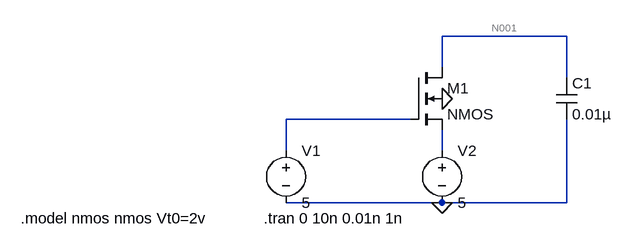
[diagram p0: schematic series_pass.asc]
series_pass.asc, the LTspice schematic file:
Version 4
SHEET 1 880 680
WIRE 448 32 256 32
WIRE 256 80 256 32
WIRE 448 96 448 32
WIRE 208 160 16 160
WIRE 16 208 16 160
WIRE 256 208 256 176
WIRE 256 288 16 288
WIRE 448 288 448 160
WIRE 448 288 256 288
FLAG 256 128 0
FLAG 256 288 0
SYMBOL voltage 16 192 R0
WINDOW 123 0 0 Left 2
WINDOW 39 0 0 Left 2
SYMATTR InstName V1
SYMATTR Value 5
SYMBOL voltage 256 192 R0
WINDOW 123 0 0 Left 2
WINDOW 39 0 0 Left 2
SYMATTR InstName V2
SYMATTR Value 5
SYMBOL nmos4 208 80 R0
SYMATTR InstName M1
SYMATTR Value2 l=5 w=10
SYMBOL cap 432 96 R0
SYMATTR InstName C1
SYMATTR Value 0.01µ
TEXT -18 312 Left 2 !.tran 0 10n 0.01n 1n
TEXT -392 312 Left 2 !.model nmos nmos Vt0=2v

The netlist it stands for:
* series_pass.asc
V1 N002 0 5
V2 N003 0 5
M1 N001 N002 N003 0 NMOS l=5 w=10
C1 N001 0 0.01µ
.model NMOS NMOS
.model PMOS PMOS
.lib standard.mos
.tran 0 10n 0.01n 1n
.model nmos nmos Vt0=2v
.backanno
.end

* Results of the author's LTspice run, read from the files saved beside the schematic
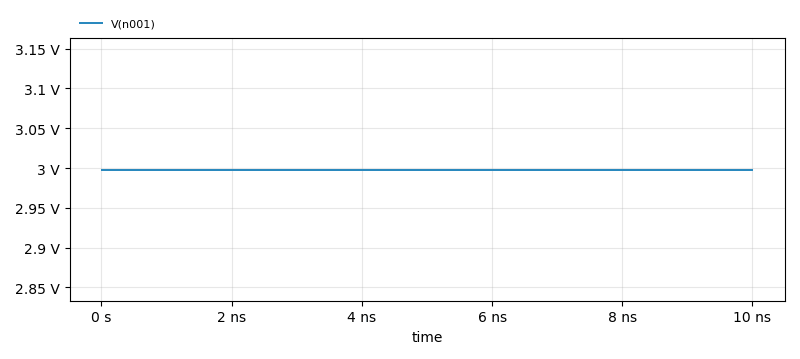
[diagram p1: Transient Analysis of series_pass.asc, plotted from the saved traces]
* Transient Analysis, 1 run:
*   V(n001): min 2.998 V, max 2.998 V, average 2.998 V, rms 2.998 V, last 2.998 V